# Altium schematic sheet rpi.SchDoc
size A4
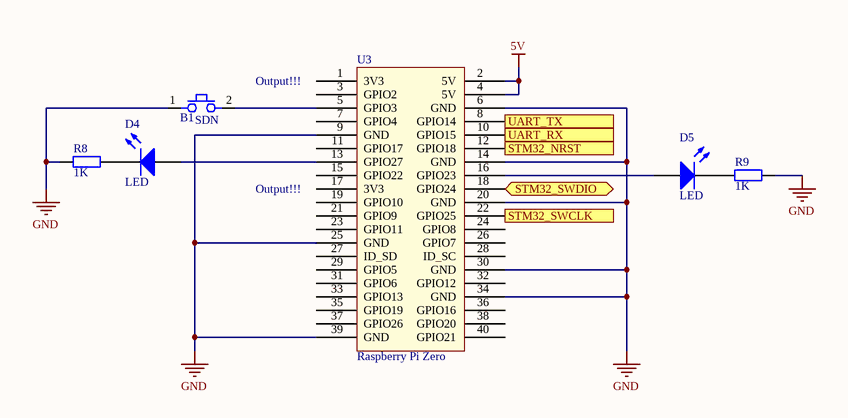
[diagram p0: rpi.SchDoc]

## Parts
B1  SDN  [FP_BTN_SMD_3x6]
D4  LED  [FP_0805_LED_RED]
D5  LED  [FP_0805_LED_RED]
R8  1K  [FP_0603_RES]
R9  1K  [FP_0603_RES]
U3  Raspberry Pi Zero  [RASPBERRY-PI-ZERO]

## Ports
STM32_NRST (out), STM32_SWCLK (out), STM32_SWDIO (bidir), UART_RX (in), UART_TX (out)

## Nets
5V: U3.2(5V) U3.4(5V)
GND: B1.1 R8.2 R9.2 U3.6(GND) U3.9(GND) U3.14(GND) U3.20(GND) U3.25(GND) U3.30(GND) U3.34(GND) U3.39(GND)
STM32_NRST: U3.12(GPIO18) ; port STM32_NRST
STM32_SWCLK: U3.22(GPIO25) ; port STM32_SWCLK
STM32_SWDIO: U3.18(GPIO24) ; port STM32_SWDIO
UART_RX: U3.10(GPIO15) ; port UART_RX
UART_TX: U3.8(GPIO14) ; port UART_TX
NetB1_2: B1.2 U3.5(GPIO3)
NetD4_1: D4.1(A) U3.13(GPIO27)
NetD4_2: D4.2(K) R8.1
NetD5_1: D5.1(A) U3.16(GPIO23)
NetD5_2: D5.2(K) R9.1

Not connected (* = marked no-connect by the designer): U3 1(3V3) 3(GPIO2) 7(GPIO4) 11(GPIO17) 15(GPIO22) 17(3V3) 19(GPIO10) 21(GPIO9) 23(GPIO11) 24(GPIO8) 26(GPIO7) 27(ID_SD) 28(ID_SC) 29(GPIO5) 31(GPIO6) 32(GPIO12) 33(GPIO13) 35(GPIO19) 36(GPIO16) 37(GPIO26) 38(GPIO20) 40(GPIO21)

## Notes on the sheet
- (near B1) Output!!!
- Output!!!

## Library data of the parts
B1 = Button 2P: Push button
D4 D5 = LED: Typical RED GaAs LED; pin to pad: 1>A 2>K
R8 R9 = RES: Resistor; Value: 1K